# Altium schematic sheet Source_and_regulation.SchDoc
size A4; SheetNumber: 5; SheetTotal: 10; SPICEModelCacheWQSZAHWV: <root> / <DocumentId>WQSZAHWV</DocumentId> / <CacheFrame Number="0"> / <Model Name="0603_150060as75000" Kind="CKT"> / <Text>************************************************** / * Manufacturer:           WÃ¼rth Elektronik / * Kinds:                  SMT Mono-color Chip LED Waterclear / * Matchcode:              WL-SMCW / * Library Type:           LTspice / * Version:                rev24a / * Created/modified by:    Ella / * Date and Time:          2024-08-23 / * Team:                   eiSos EDA Service / * Contact:                libraries@we-online.com / ************************************************** / * Copyright(C) 2024 WÃ¼rth Elektronik eiSos GmbH &amp; Co. KG / * All Rights Reserved. / ************************************************** / * Disclaimer: While WÃ¼rth Elektronik eiSos has made every reasonable effort to ensure the accuracy / * of the simulation models provided, WÃ¼rth Elektronik eiSos does not guarantee the exemption of error on / * the simulation models, nor does WÃ¼rth Elektronik eiSos guarantee that the simulation model is current. / * WÃ¼rth Elektronik eiSos reserves the right to make any adjustments at any time without notice. / * WÃ¼rth Elektronik eiSos expressly disclaims all implied warranties regarding this simulation model. / ************************************************** / .subckt 0603_150060AS75000  1  2 / D1 1 2 SMCW / .MODEL SMCW D / + IS=10.010E-21 / + N=1.8643 / + RS=1.0000E-6 / + IKF=999 / + CJO=1.0000E-12 / + M=.3333 / + VJ=.75 / + BV=100 / + TT=5.0000E-9 / .ends</Text> / </Model> / </CacheFrame> / </root>
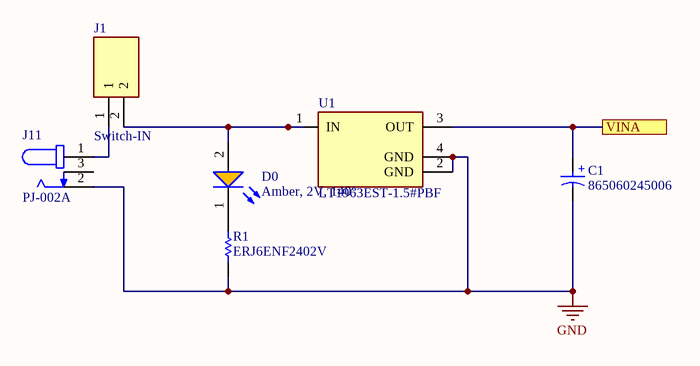
[diagram p0: Source_and_regulation.SchDoc]

## Parts
C1  865060245006  [WCAP-ASLL_D6.3H7.7]
D0  Amber, 2V, 140°  [WL-SMCW_0603_150060xx75000]
J1  Switch-IN  [TE_796949-2]
J11  PJ-002A  [CUI_PJ-002A]
R1  ERJ6ENF2402V  [RESC2013X70X40ML20T20]
U1  LT1963EST-1.5#PBF  [FP-ST-3-05-08-1630-IPC_C]

## Ports
VINA (see GlobalcircuitSchDoc[3C], Communication[3B], InputSockets[2B], Microcontroller[3C], Probe_Switches[2B], Probe_Switches[2C])

## Nets
GND: C1.2(N) J11.2 R1.1 U1.2(GND) U1.4(GND)
VINA: C1.1(P) U1.3(OUT) ; port VINA
NetD0_1: D0.1(K) R1.2
NetD0_2: D0.2(A) J1.2 U1.1(IN)
NetJ1_1: J1.1 J11.1

Not connected (* = marked no-connect by the designer): J11 3

## Notes on the sheet
- (in symbol CMP-03913-53914506-2) +

## Library data of the parts
C1 = CMP-03913-53914506-2: 865060245006 Aluminum Electrolytic Capacitor, Polarized, Aluminum (wet), 10V, 20% +Tol, 20% -Tol, 220uF, Surface Mount, 2626; Polarity: Polar; Life (Hours): 2000hours; Insulation Resistance: 454.545kΩ; Ripple Current (AC): 280mA; Ripple Current: 300mA; Capacitance: 220µF; Impedance: 360mΩ; Leakage Current: 22µA; Tolerance: 20%; Voltage Rating: 10V; Length: 7.7mm; Mount: Surface Mount; Case/Package: Radial; NexarPartId: 53914506; Max Operating Temperature: 105°C; Diameter: 6.3mm; Height: 7.7mm; RoHS: Compliant; Height - Seated (Max): 7.6962mm; Voltage Rating (DC): 10V; Min Operating Temperature: -55°C; REACH SVHC: Unknown
D0 = 150060AS75000: WL-SMCW Mono-color Chip LED Waterclear, SMT, size 0603, Amber, 2V, 140°; Manufacturer: Wurth Elektronik; Case/Size Code: 0603; Chip Technology: AlInGaP; Dominant Wavelength: 605nm; Luminous Intensity: 130mcd; Peak Wavelength: 610nm; Manufacturer Part Number: 150060AS75000; Category: Signal LEDs; Match Code: WL-SMCW; ComponentLink1Description: Website Link; ComponentLink1URL: https://www.we-online.com/redexpert/article/150060AS75000?ad; ComponentLink2Description: Datasheet Link; ComponentLink2URL: https://www.we-online.com/redexpert/spec/150060AS75000?ad; Mount: Surface Mount; Operating Temperature Max: 85°C; Operating Temperature Min: -40°C; Packaging: Tape and Reel; Length: 1.6mm; Width: 0.8mm; Height: 0.7mm; Emitting Color: Amber; Forward Voltage: 2V; Viewing Angle: 140°
J1 = 796949-2: Connector Terminal Blocks 2 Position 5.08mm Solder Straight Thru-Hole 17.5A/Contact; MF: TE Connectivity; EU_RoHS_Compliance: Compliant with Exemptions; Price: None; Availability: Unavailable; TE_purchase_URL: https://www.te.com/usa-en/product-796949-2.html?te_bu=Cor&te_type=disp&te_campaign=seda_glo_cor-seda-global-disp-prtnr-fy19-seda-model-bom-cta_sma-317_1&elqCampaignId=32493; Package: None; SnapEDA_Link: https://www.snapeda.com/parts/796949-2/TE%20Connectivity%20AMP%20Connectors/view-part/492230/?ref=snap; MP: 796949-2; Value: *
J11 = PJ-002A: 2.0 x 6.5 mm, 2.5 A, Horizontal, Through Hole, Dc Power Jack Connector; MF: CUI Devices; MP: PJ-002A; Check_prices: https://www.snapeda.com/parts/PJ-002A/CUI+Devices/view-part/?ref=eda; Availability: In Stock; CUI_purchase_URL: https://www.cuidevices.com/product/interconnect/connectors/dc-power-connectors/jacks/pj-002a?utm_source=snapeda.com&utm_medium=referral&utm_campaign=snapedaBOM; SnapEDA_Link: https://www.snapeda.com/parts/PJ-002A/CUI+Devices/view-part/?ref=snap; Purchase-URL: https://pricing.snapeda.com/search/part/PJ-002A/?ref=eda; Price: None; Package: None; Value: *
R1 = CMP-2001-00525-1: Manufacturer: Panasonic; Part Number: ERJ6ENF2402V
U1 = CMP-09138-000163-1: IC REG LINEAR 1.5V 1.5A SOT223-3; Number of Regulators: 1; Output Type: Fixed; Min Current Limit: 1.6A; Polarity: Positive; Min Input Voltage: 1.9V; Quiescent Current: 1mA; Max Input Voltage: 20V; Dropout Voltage: 340mV; Max Output Current: 1.5A; Max Operating Temperature: 125°C; Length: 6.71mm; RoHS Compliant: Yes; Mount: Surface Mount; Min Operating Temperature: -40°C; Number of Outputs: 1; Height: 1.7mm; Output Current: 1.5A; Packaging: Rail/Tube; Width: 3.71mm; Number of Pins: 3; Lead Free: Lead Free; Series: -; Case/Package: SOT-223; REACH SVHC: No SVHC; Nominal Output Voltage: 1.5V; Package Quantity: 78; Output Voltage: 1.5V